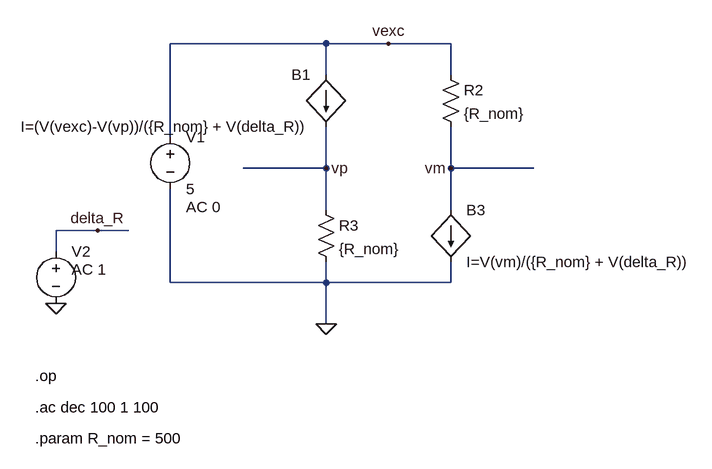
[diagram p0: schematic Wheatstone bridge.asc]
Wheatstone bridge.asc, the LTspice schematic file:
Version 4
SHEET 1 1812 680
WIRE 32 16 -208 16
WIRE 128 16 32 16
WIRE 224 16 128 16
WIRE 32 64 32 16
WIRE 224 64 224 16
WIRE -208 160 -208 16
WIRE 32 208 32 144
WIRE 32 208 -96 208
WIRE 224 208 224 144
WIRE 352 208 224 208
WIRE 32 272 32 208
WIRE 224 272 224 208
WIRE -320 304 -384 304
WIRE -272 304 -320 304
WIRE -384 336 -384 304
WIRE -208 384 -208 240
WIRE 32 384 32 352
WIRE 32 384 -208 384
WIRE 224 384 224 352
WIRE 224 384 32 384
WIRE 32 448 32 384
FLAG -384 416 0
FLAG -320 304 delta_R
FLAG 32 208 vp
FLAG 224 208 vm
FLAG 32 448 0
FLAG 128 16 vexc
DATAFLAG 304 208 ""
DATAFLAG -48 208 ""
SYMBOL res 208 48 R0
SYMATTR InstName R2
SYMATTR Value {R_nom}
SYMBOL res 16 256 R0
SYMATTR InstName R3
SYMATTR Value {R_nom}
SYMBOL voltage -208 144 R0
WINDOW 123 24 124 Left 2
WINDOW 39 0 0 Left 0
SYMATTR Value2 AC 0
SYMATTR InstName V1
SYMATTR Value 5
SYMBOL voltage -384 320 R0
WINDOW 123 24 44 Left 2
WINDOW 39 0 0 Left 0
SYMATTR Value2 AC 1
SYMATTR InstName V2
SYMATTR Value ""
SYMBOL bi 224 272 R0
SYMATTR InstName B3
SYMATTR Value I=V(vm)/({R_nom} + V(delta_R))
SYMBOL bi 32 64 M0
SYMATTR InstName B1
SYMATTR Value I=(V(vexc)-V(vp))/({R_nom} + V(delta_R))
TEXT -416 624 Left 2 !.param R_nom = 500
TEXT -416 528 Left 2 !.op
TEXT -416 576 Left 2 !.ac dec 100 1 100

The netlist it stands for:
* Wheatstone bridge.asc
R2 vexc vm {R_nom}
R3 vp 0 {R_nom}
V1 vexc 0 5 AC 0
V2 delta_R 0 AC 1
B3 vm 0 I=V(vm)/({R_nom} + V(delta_R))
B1 vexc vp I=(V(vexc)-V(vp))/({R_nom} + V(delta_R))
.param R_nom = 500
.op
.ac dec 100 1 100
.backanno
.end